# Altium schematic sheet LAN9254_D_P1.SchDoc
size 431 x 279 mm; DocumentNumber: 16; SheetNumber: 10; SheetTotal: 13
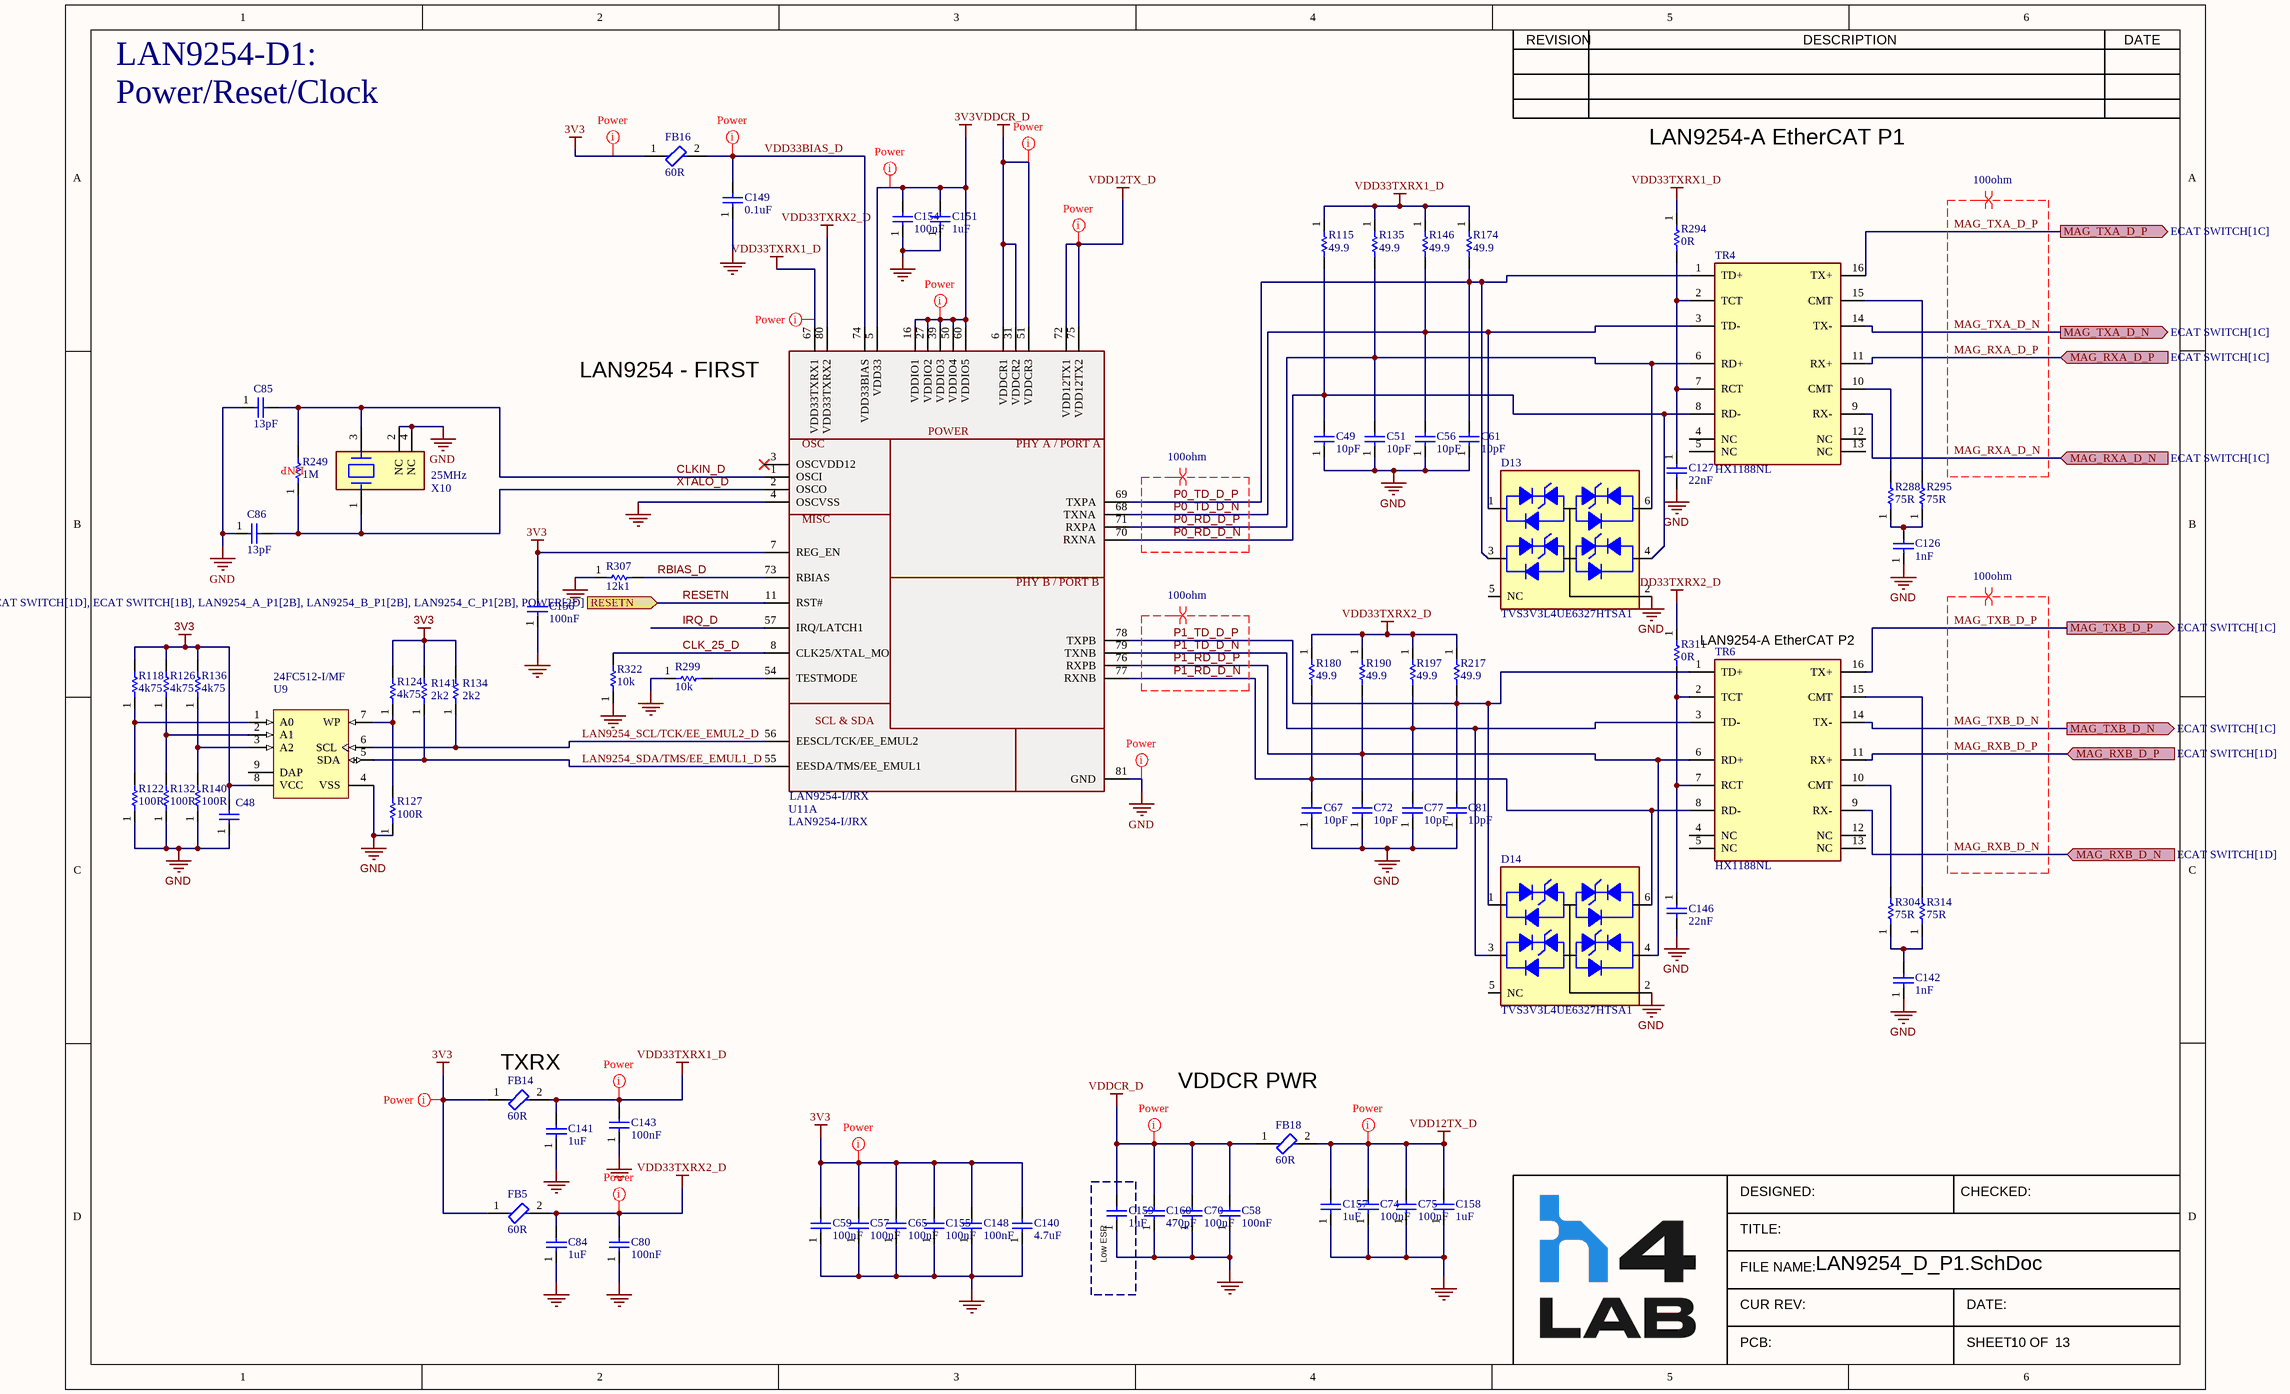
[diagram p0: LAN9254_D_P1.SchDoc]

## Parts
C48  GRM155R71C104JA88D  [CAPC1005X03N(0402)]  (value not drawn)
C49  value 10pF  [0402_C]  (hidden comment: C0402C100J5GAC7411)
C51  value 10pF  [0402_C]  (hidden comment: C0402C100J5GAC7411)
C56  value 10pF  [0402_C]  (hidden comment: C0402C100J5GAC7411)
C57  value 100nF  [CAPC1005X03N(0402)]  (hidden comment: GRM155R71C104JA88D)
C58  value 100nF  [CAPC1005X03N(0402)]  (hidden comment: GRM155R71C104JA88D)
C59  value 100nF  [CAPC1005X03N(0402)]  (hidden comment: GRM155R71C104JA88D)
C61  value 10pF  [0402_C]  (hidden comment: C0402C100J5GAC7411)
C65  value 100nF  [CAPC1005X03N(0402)]  (hidden comment: GRM155R71C104JA88D)
C67  value 10pF  [0402_C]  (hidden comment: C0402C100J5GAC7411)
C70  value 100nF  [CAPC1005X03N(0402)]  (hidden comment: GRM155R71C104JA88D)
C72  value 10pF  [0402_C]  (hidden comment: C0402C100J5GAC7411)
C74  value 100nF  [CAPC1005X03N(0402)]  (hidden comment: GRM155R71C104JA88D)
C75  value 100nF  [CAPC1005X03N(0402)]  (hidden comment: GRM155R71C104JA88D)
C77  value 10pF  [0402_C]  (hidden comment: C0402C100J5GAC7411)
C80  value 100nF  [CAPC1005X03N(0402)]  (hidden comment: GRM155R71C104JA88D)
C81  value 10pF  [0402_C]  (hidden comment: C0402C100J5GAC7411)
C84  value 1uF  [CAPC1608X09N(0603)]  (hidden comment: C0603C105K3PACTU)
C85  value 13pF  [0402_C]  (hidden comment: GRM0225C1H130GA03L)
C86  value 13pF  [0402_C]  (hidden comment: GRM0225C1H130GA03L)
C126  value 1nF  [CAPC3216X16N(1206)]  (hidden comment: CC1206KKX7RDBB102)
C127  value 22nF  [CAPC1005X03N(0402)]  (hidden comment: GCM155R71H223KA55D)
C140  value 4.7uF  [CAPC3216X16N(1206)]  (hidden comment: CL31B475KBHNNNE)
C141  value 1uF  [CAPC1608X09N(0603)]  (hidden comment: C0603C105K3PACTU)
C142  value 1nF  [CAPC3216X16N(1206)]  (hidden comment: CC1206KKX7RDBB102)
C143  value 100nF  [CAPC1005X03N(0402)]  (hidden comment: GRM155R71C104JA88D)
C146  value 22nF  [CAPC1005X03N(0402)]  (hidden comment: GCM155R71H223KA55D)
C148  value 100nF  [CAPC1005X03N(0402)]  (hidden comment: GRM155R71C104JA88D)
C149  value 0.1uF  [CAPC1608X09N(0603)]  (hidden comment: CL10B104KC8NNNC)
C151  value 1uF  [0603_C]  (hidden comment: LMK107BJ105KA-T)
C154  value 100nF  [CAPC1005X03N(0402)]  (hidden comment: GRM155R71C104JA88D)
C155  value 100nF  [CAPC1005X03N(0402)]  (hidden comment: GRM155R71C104JA88D)
C156  value 100nF  [CAPC1005X03N(0402)]  (hidden comment: GRM155R71C104JA88D)
C157  value 1uF  [CAPC1608X09N(0603)]  (hidden comment: C0603C105K3PACTU)
C158  value 1uF  [CAPC1608X09N(0603)]  (hidden comment: C0603C105K3PACTU)
C159  value 1uF  [0603_C]  (hidden comment: LMK107BJ105KA-T)
C160  value 470pF  [CAPC1005X03N(0402)]  (hidden comment: GCM1555C1H471JA16D)
D13  TVS3V3L4UE6327HTSA1  [FP-SOT457-MFG]
D14  TVS3V3L4UE6327HTSA1  [FP-SOT457-MFG]
FB5  Impedance: 60R  [FP-BKP2125-IPC_C]  (hidden comment: BKP2125HS600-T)
FB14  Impedance: 60R  [FP-BKP2125-IPC_C]  (hidden comment: BKP2125HS600-T)
FB16  Impedance: 60R  [FP-BKP2125-IPC_C]  (hidden comment: BKP2125HS600-T)
FB18  Impedance: 60R  [FP-BKP2125-IPC_C]  (hidden comment: BKP2125HS600-T)
R115  value 49.9  [RESC1005X06N(0402)]  (hidden comment: CRCW040249R9FKED)
R118  value 4k75  [RESC1005X06N(0402)]  (hidden comment: RC0402FR-074K75L)
R122  value 100R  [0402]  (hidden comment: CRGCQ0402F100R)
R124  value 4k75  [RESC1005X06N(0402)]  (hidden comment: RC0402FR-074K75L)
R126  value 4k75  [RESC1005X06N(0402)]  (hidden comment: RC0402FR-074K75L)
R127  value 100R  [0402]  (hidden comment: CRGCQ0402F100R)
R132  value 100R  [0402]  (hidden comment: CRGCQ0402F100R)
R134  value 2k2  [0402]  (hidden comment: CRCW04022K20JNED)
R135  value 49.9  [RESC1005X06N(0402)]  (hidden comment: CRCW040249R9FKED)
R136  value 4k75  [RESC1005X06N(0402)]  (hidden comment: RC0402FR-074K75L)
R140  value 100R  [0402]  (hidden comment: CRGCQ0402F100R)
R141  value 2k2  [0402]  (hidden comment: CRCW04022K20JNED)
R146  value 49.9  [RESC1005X06N(0402)]  (hidden comment: CRCW040249R9FKED)
R174  value 49.9  [RESC1005X06N(0402)]  (hidden comment: CRCW040249R9FKED)
R180  value 49.9  [RESC1005X06N(0402)]  (hidden comment: CRCW040249R9FKED)
R190  value 49.9  [RESC1005X06N(0402)]  (hidden comment: CRCW040249R9FKED)
R197  value 49.9  [RESC1005X06N(0402)]  (hidden comment: CRCW040249R9FKED)
R217  value 49.9  [RESC1005X06N(0402)]  (hidden comment: CRCW040249R9FKED)
R249  value 1M  [RESC1608X09N(0603)]  (hidden comment: RC0603FR-071ML)
R288  value 75R  [RESC1005X06N(0402)]  (hidden comment: CRCW040275R0FKEDC)
R294  value 0R  [0402]  (hidden comment: RCS04020000Z0ED)
R295  value 75R  [RESC1005X06N(0402)]  (hidden comment: CRCW040275R0FKEDC)
R299  value 10k  [RESC1005X06N(0402)]  (hidden comment: RC0402FR-0710KL)
R304  value 75R  [RESC1005X06N(0402)]  (hidden comment: CRCW040275R0FKEDC)
R307  value 12k1  [RESC1005X06N(0402)]  (hidden comment: RC0402FR-0712K1L)
R311  value 0R  [0402]  (hidden comment: RCS04020000Z0ED)
R314  value 75R  [RESC1005X06N(0402)]  (hidden comment: CRCW040275R0FKEDC)
R322  value 10k  [RESC1005X06N(0402)]  (hidden comment: RC0402FR-0710KL)
TR4  HX1188NL  [FP-HX1188NL-MFG]
TR6  HX1188NL  [FP-HX1188NL-MFG]
U9  24FC512-I/MF  [DFNS-MF8]
U11  LAN9254-I/JRX  [QFP50P1400X1400X120-81N]  (part A of 2)
X10  Frequency: 25MHz  [FP-XRCGB-MFG]  (hidden comment: XRCGB25M000F3A00R0)

## Blocks framed on the sheet
Low ESR: C159

## Ports
MAG_RXA_D_N (in, see ECAT SWITCH[1C]), MAG_RXA_D_P (in, see ECAT SWITCH[1C]), MAG_RXB_D_N (in, see ECAT SWITCH[1D]), MAG_RXB_D_P (in, see ECAT SWITCH[1D]), MAG_TXA_D_N (out, see ECAT SWITCH[1C]), MAG_TXA_D_P (out, see ECAT SWITCH[1C]), MAG_TXB_D_N (out, see ECAT SWITCH[1C]), MAG_TXB_D_P (out, see ECAT SWITCH[1C]), RESETN (in, see ECAT SWITCH[1D], ECAT SWITCH[1B], LAN9254_A_P1[2B], LAN9254_B_P1[2B], LAN9254_C_P1[2B], POWER[2D])

## Nets
3V3: C48.2 C57.2 C59.2 C65.2 C140.2 C148.2 C151.2 C154.2 C155.2 C156.2 FB5.1 FB14.1 FB16.1 R118.2 R124.2 R126.2 R134.2 R136.2 R141.2 U9.8(VCC) U11.5(VDD33) U11.7(REG_EN) U11.16(VDDIO1) U11.27(VDDIO2) U11.39(VDDIO3) U11.50(VDDIO4) U11.60(VDDIO5)
GND: C48.1 C49.1 C51.1 C56.1 C57.1 C58.1 C59.1 C61.1 C65.1 C67.1 C70.1 C72.1 C74.1 C75.1 C77.1 C80.1 C81.1 C84.1 C85.1 C86.1 C126.1 C127.2 C140.1 C141.1 C142.1 C143.1 C146.2 C148.1 C149.1 C151.1 C154.1 C155.1 C156.1 C157.1 C158.1 C159.1 C160.1 D13.2(GND) D14.2(GND) R122.1 R127.1 R132.1 R140.1 R299.1 R307.1 R322.1 U9.4(VSS) U11.4(OSCVSS) U11.81(GND) X10.2(NC) X10.4(NC)
VDD12TX_D: C74.2 C75.2 C157.2 C158.2 FB18.2 U11.72(VDD12TX1) U11.75(VDD12TX2)
VDD33TXRX1_D: C141.2 C143.2 FB14.2 R115.1 R135.1 R146.1 R174.1 R294.1 U11.67(VDD33TXRX1)
VDD33TXRX2_D: C80.2 C84.2 FB5.2 R180.1 R190.1 R197.1 R217.1 R311.1 U11.80(VDD33TXRX2)
VDDCR_D: C58.2 C70.2 C159.2 C160.2 FB18.1 U11.6(VDDCR1) U11.31(VDDCR2) U11.51(VDDCR3)
CLK_25_D: R322.2 U11.8(CLK25/XTAL_MO)
CLKIN_D: C85.2 R249.2 U11.1(OSCI) X10.3
IRQ_D: U11.57(IRQ/LATCH1)
LAN9254_SCL/TCK/EE_EMUL2_D: R134.1 U9.6(SCL) U11.56(EESCL/TCK/EE_EMUL2)
LAN9254_SDA/TMS/EE_EMUL1_D: R141.1 U9.5(SDA) U11.55(EESDA/TMS/EE_EMUL1)
MAG_RXA_D_N: TR4.9(RX-) ; port MAG_RXA_D_N
MAG_RXA_D_P: TR4.11(RX+) ; port MAG_RXA_D_P
MAG_RXB_D_N: TR6.9(RX-) ; port MAG_RXB_D_N
MAG_RXB_D_P: TR6.11(RX+) ; port MAG_RXB_D_P
MAG_TXA_D_N: TR4.14(TX-) ; port MAG_TXA_D_N
MAG_TXA_D_P: TR4.16(TX+) ; port MAG_TXA_D_P
MAG_TXB_D_N: TR6.14(TX-) ; port MAG_TXB_D_N
MAG_TXB_D_P: TR6.16(TX+) ; port MAG_TXB_D_P
P0_RD_D_N: C49.2 D13.4 R115.2 TR4.8(RD-) U11.70(RXNA)
P0_RD_D_P: C51.2 D13.6 R135.2 TR4.6(RD+) U11.71(RXPA)
P0_TD_D_N: C56.2 D13.1 R146.2 TR4.3(TD-) U11.68(TXNA)
P0_TD_D_P: C61.2 D13.3 R174.2 TR4.1(TD+) U11.69(TXPA)
P1_RD_D_N: C67.2 D14.6 R180.2 TR6.8(RD-) U11.77(RXNB)
P1_RD_D_P: C72.2 D14.4 R190.2 TR6.6(RD+) U11.76(RXPB)
P1_TD_D_N: C77.2 D14.3 R197.2 TR6.3(TD-) U11.79(TXNB)
P1_TD_D_P: C81.2 D14.1 R217.2 TR6.1(TD+) U11.78(TXPB)
RBIAS_D: R307.2 U11.73(RBIAS)
RESETN: U11.11(RST#) ; port RESETN
VDD33BIAS_D: C149.2 FB16.2 U11.74(VDD33BIAS)
XTALO_D: C86.2 R249.1 U11.2(OSCO) X10.1
NetC126_2: C126.2 R288.1 R295.1
NetC127_1: C127.1 R294.2 TR4.2(TCT) TR4.7(RCT)
NetC142_2: C142.2 R304.1 R314.1
NetC146_1: C146.1 R311.2 TR6.2(TCT) TR6.7(RCT)
NetR118_1: R118.1 R122.2 U9.1(A0)
NetR124_1: R124.1 R127.2 U9.7(WP)
NetR126_1: R126.1 R132.2 U9.2(A1)
NetR136_1: R136.1 R140.2 U9.3(A2)
NetR288_2: R288.2 TR4.10(CMT)
NetR295_2: R295.2 TR4.15(CMT)
NetR299_2: R299.2 U11.54(TESTMODE)
NetR304_2: R304.2 TR6.10(CMT)
NetR314_2: R314.2 TR6.15(CMT)

Not connected (* = marked no-connect by the designer): D13 5(NC); D14 5(NC); TR4 4(NC) 5(NC) 12(NC) 13(NC); TR6 4(NC) 5(NC) 12(NC) 13(NC); U9 9(DAP); U11 3(OSCVDD12)*

## Layout directives
net class Power: 3V3, GND, VDD12TX_D, VDD33BIAS_D, VDD33TXRX1_D, VDD33TXRX2_D, VDDCR_D
differential pair; differential pair class 100ohm: MAG_RXA_D_N, MAG_RXA_D_P, MAG_RXB_D_N, MAG_RXB_D_P, MAG_TXA_D_N, MAG_TXA_D_P, MAG_TXB_D_N, MAG_TXB_D_P, P0_RD_D_N, P0_RD_D_P, P0_TD_D_N, P0_TD_D_P, P1_RD_D_N, P1_RD_D_P, P1_TD_D_N, P1_TD_D_P

## Notes on the sheet
- LAN9254-D1:
- Power/Reset/Clock
- LAN9254-A EtherCAT P1
- (near U11) LAN9254 - FIRST
- (near R249) DNP
- LAN9254-A EtherCAT P2
- (near FB14) TXRX
- VDDCR PWR
- REVISION
- DESCRIPTION
- DATE
- DESIGNED:
- CHECKED:
- TITLE:
- FILE NAME:
- CUR REV:
- PCB:
- SHEET:
- DATE:
- OF
- (in symbol LAN9254-I/JRX, part A) POWER; OSC; PHY A / PORT A; MISC; PHY B / PORT B; SCL & SDA

## Library data of the parts
C48 = 100nF_16V_0402_CAP: CAP CER 0.1UF 16V X7R 0402; Value: 100nF; Tolerance: 5%; MPN: GRM155R71C104JA88D; Voltage Rating: 16V; Temp Coeff: X7R; Size/Package: 0402
C49 C51 C56 C61 C67 C72 C77 C81 = 10pF_50V_0402_C0402C100J5GAC7411: Cap Ceramic 10pF 50V C0G 5% SMD 0402 125°C Punched Paper T/R; Manufacturer: KEMET; Tolerance: 5%; Supplier 1: Digi-Key; Manufacturer Part Number: C0402C100J5GAC7411; RoHS: Yes; Category: Ceramic Capacitors; Stock 1: 39987; Pricing 1: 1=0.10000, 10=0.03500, 50=0.01940, 100=0.01580, 500=0.01128, 1000=0.00886, 2500=0.00805, 5000=0.00741 (USD); Case/Package: 0402; Dielectric Material: Ceramic; Min Operating Temperature: -55°C; Max Operating Temperature: 125°C; Packaging: Tape and Reel; Capacitance: 10pF; Dielectric: C0G; Voltage Rating (DC): 50V; Length: 1mm; Depth: 0.5mm; Lead Free: Lead Free; RoHS Compliant: Yes; ComponentLink1URL: http://components.arrow.com/part/dataview/0323_00309912?src-supplier=Arrow+Europe; ComponentLink1Description: http://components.arrow.com/part/dataview/0323_00309912?src-supplier=Arrow+Europe; Supplier Part Number 1: 399-C0402C100J5GAC7411CT-ND
C57-C59 C65 C70 C74 C75 C80 C143 C148 C154-C156 = 100nF_16V_0402_CAP: CAP CER 0.1UF 16V X7R 0402; Tolerance: 5%; MPN: GRM155R71C104JA88D; Voltage Rating: 16V; Temp Coeff: X7R; Size/Package: 0402
C84 C141 C157 C158 = 1uF_25VDC_0603_Cap: MLCC - SMD/SMT 25volts 1uF X5R 10%; Voltage: 25VDC; Drawn By: TC; MPN: C0603C105K3PACTU; Tolerance: 10%; Supplier 1: Mouser; Supplier Part Number 1: 80-C0603C105K3PAC
C85 C86 = 13pF_50V_0402_CAP_GRM0225C1H130GA03L: Cap Ceramic Monolithic 13pF 50VDC 2% SMD Emboss T/R; Manufacturer: Murata; Supplier 1: Digi-Key; Manufacturer Part Number: GRM0225C1H130GA03L; RoHS: Yes; Category: Ceramic Capacitors; Pricing 1: 40000=0.01108 (USD); RoHS Compliant: Yes; Supplier Part Number 1: 490-GRM0225C1H130GA03LTR-ND
C126 C142 = 1nF_2kV_1206_CAP: CAP CER 1000PF 2KV X7R 1206; Tolerance: 10%; Voltage Rating: 2kV; MPN: CC1206KKX7RDBB102; Temp Coeff: X7R; Size/Package: 1206
C127 C146 = 22nF_50V_0402_CAP: CAP CER 0.022UF 50V X7R 0402; Tolerance: 10%; MPN: GCM155R71H223KA55D; Voltage Rating: 50V; Temp Coeff: X7R; Size/Package: 0402; Mounting Type: Surface Mounting
C140 = 4.7uF_50V_1206_CAP: CAP CER 4.7UF 50V X7R 1206; Tolerance: 10%; MPN: CL31B475KBHNNNE; Voltage: 50V; Temp Coeff: X7R; Package/Case: 1206
C149 = 0.1uF_100V_0603_CAP: CAP CER 0.1UF 100V X7R 0603; Tolerance: 10%; MPN: CL10B104KC8NNNC; Supplier 1: Digi-Key; Supplier Part Number 1: 1276-6807-1-ND; Volage Rating: 100V; Temp Coefficent: X7R; Mounting Type: Surface Mount; Case/Package: 0603
C151 C159 = 1uF_10V_low_ESR_0603_LMK107BJ105KA-T: Multilayer Ceramic Capacitors (High dielectric type), 10V, 1 uF, ± 10 %, 0603, X5R, RoHS; Manufacturer: Taiyo Yuden; Tolerance: 10%; Supplier 1: Digi-Key; Supplier Part Number 1: 587-4281-1-ND; Manufacturer Part Number: LMK107BJ105KA-T; RoHS: Yes; Category: Ceramic Capacitors; Stock 1: 254397; Pricing 1: 1=0.10000, 10=0.05800, 50=0.03180, 100=0.02590, 500=0.01852, 1000=0.01455 (USD); Mount: Surface Mount; Case/Package: 0603; Case Code (Imperial): 0603; Case Code (Metric): 1608; Min Operating Temperature: -55°C; Max Operating Temperature: 85°C; Packaging: Tape and Reel; Capacitance: 1uF; Voltage Rating (DC): 10V; Dielectric: X5R; Package Quantity: 4000; Voltage Rating: 10V; Termination: SMD/SMT; Resistor Type: Ceramic; Series: M; Construction: Flat; Length: 1.6mm; Width: 0.8mm; Height: 0.8mm; Thickness: 0.035inch; Depth: 0.8mm; Radiation Hardening: No; Lead Free: Lead Free; Halogen Free: Halogen Free; RoHS Compliant: Yes; ComponentLink1URL: https://datasheet.ciiva.com/11596/lmk107bj105ka-t-ss-11596793.pdf?src-supplier=Avnet; ComponentLink1Description: https://datasheet.ciiva.com/11596/lmk107bj105ka-t-ss-11596793.pdf?src-supplier=Avnet; ComponentLink2URL: https://datasheet.ciiva.com/15921/1054lmk107bj105ka-t-15921296.pdf?src-supplier=Onlinecomponents.com; ComponentLink2Description: https://datasheet.ciiva.com/15921/1054lmk107bj105ka-t-15921296.pdf?src-supplier=Onlinecomponents.com; ComponentLink3URL: https://datasheet.ciiva.com/26872/getdatasheetpartid-637529-26872638.pdf?src-supplier=Verical; ComponentLink3Description: https://datasheet.ciiva.com/26872/getdatasheetpartid-637529-26872638.pdf?src-supplier=Verical; ComponentLink4URL: https://datasheet.ciiva.com/30232/584lmk107bj105ka-t-30232760.pdf?src-supplier=Onlinecomponents.com; ComponentLink4Description: https://datasheet.ciiva.com/30232/584lmk107bj105ka-t-30232760.pdf?src-supplier=Onlinecomponents.com
C160 = 470pF_50V_0402_CAP: CAP CER 470PF 50V C0G/NP0 0402; Tolerance: 5%; Temp Coeff: C0G, NP0; MPN: GCM1555C1H471JA16D; Voltage: 50V; Size: 0402
D13 D14 = TVS_DIODE_ETHERCAT_PHY_7.7V_20A_TVS3V3L4UE6327HTSA1: Trans Voltage Suppressor Diode, 3.3V V(RWM), Unidirectional, 4 Element, Silicon; Manufacturer: Infineon; Supplier: Digi-Key; Supplier Part Number: TVS3V3L4UE6327HTSA1CT-ND; Manufacturer Part Number: TVS3V3L4UE6327HTSA1; RoHS: Yes; Category: Diodes; Stock: 273244; Pricing: 1=0.54, 10=0.438, 100=0.2981, 500=0.22356, 1000=0.16767 (USD); Terminal Finish: Tin; Diode Type: TRANS VOLTAGE SUPPRESSOR; Moisture Sensitivity Level: 1; JESD-609 Code: e3; Reach SVHC Compliant: Yes; RoHS Compliant: Yes; ComponentLink1URL: https://datasheet.ciiva.com:443/pdfs/VipMasterIC/IC/INFN/INFNS19177/INFNS19177-1.pdf?src-supplier=IHS+Markit; ComponentLink1Description: https://datasheet.ciiva.com:443/pdfs/VipMasterIC/IC/INFN/INFNS19177/INFNS19177-1.pdf?src-supplier=IHS+Markit; ComponentLink2URL: http://www.farnell.com/datasheets/1945807.pdf?src-supplier=Farnell; ComponentLink2Description: http://www.farnell.com/datasheets/1945807.pdf?src-supplier=Farnell; ComponentLink3URL: http://www.mouser.com/ds/2/196/Infineon-TVS3V3L4U-DS-v02_04-en-469488.pdf?src-supplier=Mouser; ComponentLink3Description: http://www.mouser.com/ds/2/196/Infineon-TVS3V3L4U-DS-v02_04-en-469488.pdf?src-supplier=Mouser; ComponentLink4URL: http://www.farnell.com/datasheets/1945807.pdf?src-supplier=Element14; ComponentLink4Description: http://www.farnell.com/datasheets/1945807.pdf?src-supplier=Element14; ComponentLink5URL: http://www.farnell.com/datasheets/1945807.pdf?src-supplier=Newark; ComponentLink5Description: http://www.farnell.com/datasheets/1945807.pdf?src-supplier=Newark; ComponentLink6URL: http://www.infineon.com/dgdl/Infineon-TVS3V3L4U-DS-v02_04-en.pdf?fileId=db3a3043382e837301385be7912532ed&src-supplier=Avnet; ComponentLink6Description: http://www.infineon.com/dgdl/Infineon-TVS3V3L4U-DS-v02_04-en.pdf?fileId=db3a3043382e837301385be7912532ed&src-supplier=Avnet; ComponentLink7URL: https://www.infineon.com/dgdl/TVS3V3L4U_rev_2_2.pdf?folderId=db3a30431f848401011fcbf2ab4c04c4&fileId=db3a3043382e837301385be7912532ed&src-supplier=Digi-Key; ComponentLink7Description: https://www.infineon.com/dgdl/TVS3V3L4U_rev_2_2.pdf?folderId=db3a30431f848401011fcbf2ab4c04c4&fileId=db3a3043382e837301385be7912532ed&src-supplier=Digi-Key; ComponentLink8URL: https://www.infineon.com/dgdl/TVS3V3L4U_rev_2_2.pdf?folderId=db3a30431f848401011fcbf2ab4c04c4&amp;fileId=db3a3043382e837301385be7912532ed&src-supplier=Digi-Key; ComponentLink8Description: https://www.infineon.com/dgdl/TVS3V3L4U_rev_2_2.pdf?folderId=db3a30431f848401011fcbf2ab4c04c4&amp;fileId=db3a3043382e837301385be7912532ed&src-supplier=Digi-Key
FB5 FB14 FB16 FB18 = 60R_100Mhz_0805_3A: TAIYO YUDEN - BKP2125HS600-T - Ferrite Bead, 0805 [2012 Metric], 60 ohm, 3 A, BKP Series, 0.025 ohm, ± 25%; Max DC Current: 3A; Number of Lines: 1; DC Resistance (DCR): 25mR; Test Frequency: 100MHz; Shielding: Unshielded; Packaging: Tape and Reel; Case Code (Imperial): 0805; Series: BK; Package Quantity: 1; Tolerance: 25%; Lead Free: Lead Free; Number of Pins: 2; Max Current Rating: 3A; Length: 2.3mm; Case/Package: 0805; Max Operating Temperature: 85°C; Min Operating Temperature: -55°C; Core Material: Ferrite; Case Code (Metric): 2125; Depth: 1.45mm; Resistance: 25mR; Halogen Free: Halogen Free; Termination: SMD/SMT; Width: 0.049inch; RoHS Compliant: Yes; Mount: Surface Mount; Height: 1.05mm; Supplier 1: Digi-Key; Manufacturer: Taiyo Yuden; Manufacturer Part Number: BKP2125HS600-T; RoHS: Yes; Category: Inductors; Stock 1: 308405; Pricing 1: 1=0,12000, 10=0,09400, 25=0,08480, 50=0,06200, 100=0,05360, 250=0,04232, 500=0,03574, 1000=0,03010 (USD); REACH SVHC: Unknown; ComponentLink1URL: https://datasheet.ciiva.com/6213/bkp2125hs600-t-ss-6213090.pdf?src-supplier=Digi-Key; ComponentLink1Description: https://datasheet.ciiva.com/6213/bkp2125hs600-t-ss-6213090.pdf?src-supplier=Digi-Key; ComponentLink2URL: https://datasheet.ciiva.com/30063/884bkp2125hs600-t-30063956.pdf?src-supplier=Onlinecomponents.com; ComponentLink2Description: https://datasheet.ciiva.com/30063/884bkp2125hs600-t-30063956.pdf?src-supplier=Onlinecomponents.com; ComponentLink3URL: https://datasheet.ciiva.com/6213/mlci08-e-6213094.pdf?src-supplier=Digi-Key; ComponentLink3Description: https://datasheet.ciiva.com/6213/mlci08-e-6213094.pdf?src-supplier=Digi-Key; ComponentLink4URL: https://datasheet.ciiva.com/6213/mlci08-e-6213097.pdf?src-supplier=Digi-Key; ComponentLink4Description: https://datasheet.ciiva.com/6213/mlci08-e-6213097.pdf?src-supplier=Digi-Key; Supplier Part Number 1: 587-1932-1-ND
R115 R135 R146 R174 R180 R190 R197 R217 = 49R9_1/10W_0402_RES: RES SMD 49.9 OHM 1% 1/16W 0402; MPN: CRCW040249R9FKED; Wattage: 1/16W; Drawn By: TC; Tolerance: 1%; Supplier 1: Digi-Key; Supplier Part Number 1: 541-49.9LCT-ND
R118 R124 R126 R136 = 4k75_1/16_0402_RES: RES SMD 4.75K OHM 1% 1/16W 0402; Power: 1/16; MPN: RC0402FR-074K75L; Tolerance: 1%; Package/Case: 0402
R122 R127 R132 R140 = 100R_1/16_0402_RES: Res Thick Film 0402 100 Ohm 1% 0.063W(1/16W) ±200ppm/C Pad SMD Automotive T/R; Manufacturer: TE Connectivity; Max Power Dissipation: 63mW; Temperature Coefficient: 200ppm/°C; Supplier 1: Digi-Key; Manufacturer Part Number: CRGCQ0402F100R; RoHS: Yes; Category: Chip SMD Resistors; Stock 1: 151133; Pricing 1: 1=0.10000, 10=0.02600, 100=0.01040, 1000=0.00466, 2500=0.00405, 5000=0.00334 (USD); Case/Package: 0402; Case Code (Imperial): 0402; Case Code (Metric): 1005; Min Operating Temperature: -55°C; Max Operating Temperature: 155°C; Resistor Type: Thick Film; Features: Moisture Resistant,Automotive AEC-Q200; Packaging: Cut Tape; Resistance: 100R; Tolerance: 1%; Number of Terminations: 2; RoHS Compliant: Yes; ComponentLink1URL: https://www.te.com/commerce/DocumentDelivery/DDEController?Action=srchrtrv&amp;DocNm=1773204-3&amp;DocType=DS&amp;DocLang=English&src-supplier=Digi-Key; ComponentLink1Description: https://www.te.com/commerce/DocumentDelivery/DDEController?Action=srchrtrv&amp;DocNm=1773204-3&amp;DocType=DS&amp;DocLang=English&src-supplier=Digi-Key; ComponentLink2URL: https://4donline.ihs.com/images/VipMasterIC/IC/TYEL/TYEL-S-A0004929575/TYEL-S-A0004929575-1.pdf?hkey=52A5661711E402568146F3353EA87419&src-supplier=Element14; ComponentLink2Description: https://4donline.ihs.com/images/VipMasterIC/IC/TYEL/TYEL-S-A0004929575/TYEL-S-A0004929575-1.pdf?hkey=52A5661711E402568146F3353EA87419&src-supplier=Element14; ComponentLink3URL: https://4donline.ihs.com/images/VipMasterIC/IC/TYEL/TYEL-S-A0004929575/TYEL-S-A0004929575-1.pdf?hkey=52A5661711E402568146F3353EA87419&src-supplier=Newark; ComponentLink3Description: https://4donline.ihs.com/images/VipMasterIC/IC/TYEL/TYEL-S-A0004929575/TYEL-S-A0004929575-1.pdf?hkey=52A5661711E402568146F3353EA87419&src-supplier=Newark; ComponentLink4URL: https://4donline.ihs.com/images/VipMasterIC/IC/TYEL/TYEL-S-A0004929575/TYEL-S-A0004929575-1.pdf?hkey=52A5661711E402568146F3353EA87419&src-supplier=Farnell; ComponentLink4Description: https://4donline.ihs.com/images/VipMasterIC/IC/TYEL/TYEL-S-A0004929575/TYEL-S-A0004929575-1.pdf?hkey=52A5661711E402568146F3353EA87419&src-supplier=Farnell; Supplier Part Number 1: A129615CT-ND
R134 R141 = 2k2_1/16_0402_CRCW04022K20JNED_RES: Vishay CRCW Series Thick Film Resistor 0402 Case 2.2k 5% 0.063W 200ppm/K; Manufacturer: Vishay Dale; Resistance: 2.2kR; Temperature Coefficient: 200ppm/°C; Max Power Dissipation: 63mW; Voltage Rating: 50V; Tolerance: 5%; Supplier 1: Digi-Key; Manufacturer Part Number: CRCW04022K20JNED; RoHS: Yes; Category: Chip SMD Resistors; Stock 1: 5003; Pricing 1: 1=0,10000, 10=0,03300, 100=0,01360, 1000=0,00610, 2500=0,00529, 5000=0,00437 (USD); Mount: Surface Mount; Case/Package: 0402; Case Code (Imperial): 0402; Case Code (Metric): 1005; Contact Plating: Tin; Weight: 2.3E-05oz; Size Code: 0402; Min Operating Temperature: -55°C; Max Operating Temperature: 155°C; Resistor Type: Thick Film; Packaging: Tape and Reel; Number of Terminations: 2; Power Rating: 63mW; Package Quantity: 1; Features: Automotive AEC-Q200; Termination: SMD/SMT; Voltage Rating (DC): 50V; Series: CRCW; Resistance Tolerance: 5%; Construction: Rectangular; Technology: THICK FILM; Length: 1mm; Width: 0.5mm; Height: 0.35mm; Depth: 0.5mm; Radiation Hardening: No; RoHS Compliant: Yes; Lead Free: Lead Free; REACH SVHC: Unknown; Military Standard: Not; ComponentLink1URL: https://datasheet.ciiva.com/5542/dcrcwe3-109170-5542006.pdf?src-supplier=Mouser; ComponentLink1Description: https://datasheet.ciiva.com/5542/dcrcwe3-109170-5542006.pdf?src-supplier=Mouser; ComponentLink2URL: https://datasheet.ciiva.com/3256/dcrcwe3-3256342.pdf?src-supplier=Avnet; ComponentLink2Description: https://datasheet.ciiva.com/3256/dcrcwe3-3256342.pdf?src-supplier=Avnet; ComponentLink3URL: https://datasheet.ciiva.com/3256/dcrcwe3-3256343.pdf?src-supplier=Avnet; ComponentLink3Description: https://datasheet.ciiva.com/3256/dcrcwe3-3256343.pdf?src-supplier=Avnet; ComponentLink4URL: https://datasheet.ciiva.com/2462/dcrcwe3-2462040.pdf?src-supplier=Digi-Key; ComponentLink4Description: https://datasheet.ciiva.com/2462/dcrcwe3-2462040.pdf?src-supplier=Digi-Key; ComponentLink5URL: https://datasheet.ciiva.com/2462/dcrcwe3-2462041.pdf?src-supplier=Digi-Key; ComponentLink5Description: https://datasheet.ciiva.com/2462/dcrcwe3-2462041.pdf?src-supplier=Digi-Key; ComponentLink6URL: https://datasheet.ciiva.com/2462/dcrcwe3-2462042.pdf?src-supplier=Digi-Key; ComponentLink6Description: https://datasheet.ciiva.com/2462/dcrcwe3-2462042.pdf?src-supplier=Digi-Key; ComponentLink7URL: https://datasheet.ciiva.com/16760/70201119-16760139.pdf?src-supplier=Allied+Electronics; ComponentLink7Description: https://datasheet.ciiva.com/16760/70201119-16760139.pdf?src-supplier=Allied+Electronics; ComponentLink8URL: https://datasheet.ciiva.com/16436/dcrcwe3-16436154.pdf?src-supplier=Future+Electronics; ComponentLink8Description: https://datasheet.ciiva.com/16436/dcrcwe3-16436154.pdf?src-supplier=Future+Electronics; ComponentLink9URL: https://datasheet.ciiva.com/7743/dcrcwe3-7743566.pdf?src-supplier=Element14; ComponentLink9Description: https://datasheet.ciiva.com/7743/dcrcwe3-7743566.pdf?src-supplier=Element14; Supplier Part Number 1: 541-2.2KJCT-ND
R249 = 1M_1/10W_RES_0603: RES SMD 1M OHM 1% 1/10W 0603; MPN: RC0603FR-071ML; Tolerance: 1%; Power: 1/10W; Size: 0603; Supplier 1: Digi-Key; Supplier Part Number 1: 311-1.00MHRCT-ND
R288 R295 R304 R314 = 75R_1/10W_0402_RES: RES SMD 75 OHM 1% 1/16W 0402; Tolerance: +/-1%; MPN: CRCW040275R0FKEDC; Wattage: 1/16W; Drawn By: TC; Size/Package: 0402
R294 R311 = 0R_1/5W_0402_RCS04020000Z0ED_RES: VISHAY - RCS04020000Z0ED - SMD Chip Resistor, 0402 [1005 Metric], 0 ohm, RCS Series, 50 V, Thick Film, 200 mW; Manufacturer: Vishay Dale; Resistance: 0mR; Max Power Dissipation: 200mW; Supplier 1: Digi-Key; Supplier Part Number 1: 541-2877-1-ND; Manufacturer Part Number: RCS04020000Z0ED; RoHS: Yes; Category: Chip SMD Resistors; Stock 1: 18214; Pricing 1: 1=0.10000, 10=0.08300, 25=0.05760, 50=0.04480, 100=0.03200, 250=0.02496, 500=0.01984, 1000=0.01408, 5000=0.01088 (USD); Case/Package: 0402; Case Code (Metric): 1005; Case Code (Imperial): 0402; Min Operating Temperature: -55°C; Max Operating Temperature: 155°C; Packaging: Tape and Reel; Resistor Type: Thick Film; Number of Terminations: 2; Features: Automotive AEC-Q200; Length: 0.039inch; Width: 0.02inch; Height: 0.016inch; RoHS Compliant: Yes; ComponentLink1URL: http://www.farnell.com/datasheets/2618474.pdf?src-supplier=Farnell; ComponentLink1Description: http://www.farnell.com/datasheets/2618474.pdf?src-supplier=Farnell; ComponentLink2URL: http://www.vishay.com/docs/20065/rcse3.pdf?src-supplier=Digi-Key; ComponentLink2Description: http://www.vishay.com/docs/20065/rcse3.pdf?src-supplier=Digi-Key; ComponentLink3URL: http://www.farnell.com/datasheets/2618474.pdf?src-supplier=Element14; ComponentLink3Description: http://www.farnell.com/datasheets/2618474.pdf?src-supplier=Element14; ComponentLink4URL: http://www.farnell.com/datasheets/2618474.pdf?src-supplier=Newark; ComponentLink4Description: http://www.farnell.com/datasheets/2618474.pdf?src-supplier=Newark
R299 R322 = 10k_1/16W_0402_RES: RES SMD 10K OHM 1% 1/16W 0402; Tolerance: 1%; Power: 1/16W; Size: 0402; MPN: RC0402FR-0710KL
R307 = 12k1_1/16W-0402_RES: RES SMD 12.1K OHM 1% 1/16W 0402; MPN: RC0402FR-0712K1L; Tolerance: 1%; Power: 1/16W; Case/Package: 0402
TR4 TR6 = HX1188NL_TRANSFO_LAN_-40-85DEG: Datacom Transformer, GENERAL PURPOSE Application(s), 1:1; 1:1; Manufacturer: Pulse; Isolation Voltage: 1.65kV; Channels: 1; Primary Inductance: 350uH; Manufacturer Part Number: HX1188NL; RoHS: Yes; Category: Transformers; Min Operating Temperature: -40°C; Max Operating Temperature: 85°C; Turns Ratio: 1:1; Packaging: Rail/Tube; Length: 12.7mm; Width: 7.11mm; Height: 5.97mm; ComponentLink1URL: https://datasheet.ciiva.com:443/pdfs/VipMasterIC/IC/PLEI/PLEI-S-A0005794621/PLEI-S-A0005794621-1.pdf?src-supplier=IHS+Markit; ComponentLink1Description: https://datasheet.ciiva.com:443/pdfs/VipMasterIC/IC/PLEI/PLEI-S-A0005794621/PLEI-S-A0005794621-1.pdf?src-supplier=IHS+Markit; RoHS Compliant: Yes; Supplier: Digi-Key; Supplier Part Number: 553-1340-5-ND; Stock: 14377; Pricing: 1=5.68, 10=4.314, 25=4.2004, 50=3.86, 100=3.6329, 250=3.5194, 500=3.40588, 1000=3.29234 (USD); Mounting Technology: Surface Mount; Terminal Finish: Nickel; Application(s): GENERAL PURPOSE; Transformer Type: DATACOM TRANSFORMER; JESD-609 Code: e3; Reach SVHC Compliant: Yes; ComponentLink2URL: https://datasheet.ciiva.com/2938/+hj603-2938785.pdf?src-supplier=Digi-Key; ComponentLink2Description: https://datasheet.ciiva.com/2938/+hj603-2938785.pdf?src-supplier=Digi-Key
U9 = EEPROM_512kb_1MHz_24FC512-I/MF: EEPROM Serial-2Wire 512K-bit 64K x 8 1.8V/2.5V/3.3V/5V 8-Pin DFN-S EP Tube; Manufacturer: Microchip; Interface: I2C,Serial; Frequency: 400kHz; Min Supply Voltage: 1.7V; Max Supply Voltage: 5.5V; Access Time: 400ns; Nominal Supply Current: 5mA; Density: 512Kb; Max Frequency: 1MHz; Organization: 64KX8; Access Time-Max: 900ns; Write Protection: YES; Write Cycle Time-Max (tWC): 5ms; Supplier 1: Digi-Key; Manufacturer Part Number: 24FC512-I/MF; RoHS: Yes; Category: EEPROM; Pricing 1: 1=2.16000 (USD); Mount: Surface Mount; Number of Pins: 8; Contact Plating: Tin,Matte; Min Operating Temperature: -40°C; Max Operating Temperature: 85°C; Packaging: Rail/Tube; Memory Type: EEPROM; Package Quantity: 60; Memory Size: 512Kb; Supply Current: 5mA; REACH SVHC: No SVHC; Lead Free: Lead Free; RoHS Compliant: Yes; ComponentLink1URL: https://datasheet.ciiva.com/3185/21754m-3185247.pdf?src-supplier=Avnet; ComponentLink1Description: https://datasheet.ciiva.com/3185/21754m-3185247.pdf?src-supplier=Avnet; Supplier Part Number 1: 24FC512-I/MF-ND; Case/Package: DFN; Programming Voltage: 5.5V; Supply Voltage-Nom: 5.5V; Radiation Hardening: No; ComponentLink2URL: https://datasheet.ciiva.com/16321/filehandler-aspxddocname-en546203-16321085.pdf?src-supplier=Future+Electronics; ComponentLink2Description: https://datasheet.ciiva.com/16321/filehandler-aspxddocname-en546203-16321085.pdf?src-supplier=Future+Electronics
U11 = LAN9254-I/JRX: 2/3-PORT Ethercat Slave Controller With 32 Digios With Integrated Ethernet Phys; Manufacturer: Microchip; Supplier 1: Digi-Key; Manufacturer Part Number: LAN9254-I/JRX; RoHS: Yes; Pricing 1: 1=14.24000, 25=12.99000 (USD); RoHS Compliant: Yes; Supplier Part Number 1: 150-LAN9254-I/JRX-ND
X10 = 25MHz_Crystal_2016_35PPM_XRCGB25M000F3A00R0: Crystal 25MHz ±30ppm (Tol) ±35ppm (Stability) 6pF 100Ohm Automotive 4-Pin SMD T/R; Manufacturer: Murata; ESR (Equivalent Series Resistance): 100R; Frequency Stability: 100ppm; Load Capacitance: 6pF; Supplier 1: Digi-Key; Manufacturer Part Number: XRCGB25M000F3A00R0; RoHS: Yes; Category: Crystals; Stock 1: 53614; Pricing 1: 1=0.56000, 10=0.46300, 50=0.41640, 100=0.37010, 500=0.35156, 1000=0.29605 (USD); Mount: Surface Mount; Case/Package: SMD/SMT; Min Operating Temperature: -40°C; Max Operating Temperature: 125°C; Packaging: Tape and Reel; Frequency Tolerance: 35ppm; Length: 0.079inch; Width: 0.063inch; Height: 0.028inch; Ratings: AEC-Q200; RoHS Compliant: Yes; ComponentLink1URL: http://www.farnell.com/datasheets/2631968.pdf?src-supplier=Farnell; ComponentLink1Description: http://www.farnell.com/datasheets/2631968.pdf?src-supplier=Farnell; ComponentLink2URL: http://www.murata.com/~/media/webrenewal/products/timingdevice/crystalu/flyers/vppt-hcrj126-d.ashx?la=en&src-supplier=Digi-Key; ComponentLink2Description: http://www.murata.com/~/media/webrenewal/products/timingdevice/crystalu/flyers/vppt-hcrj126-d.ashx?la=en&src-supplier=Digi-Key; ComponentLink3URL: https://www.murata.com/~/media/webrenewal/products/timingdevice/crystalu/flyers/vppt-hcrj126-d.ashx?la=en&src-supplier=Digi-Key; ComponentLink3Description: https://www.murata.com/~/media/webrenewal/products/timingdevice/crystalu/flyers/vppt-hcrj126-d.ashx?la=en&src-supplier=Digi-Key; ComponentLink4URL: http://www.farnell.com/datasheets/2631968.pdf?src-supplier=Newark; ComponentLink4Description: http://www.farnell.com/datasheets/2631968.pdf?src-supplier=Newark; Supplier Part Number 1: 490-12146-1-ND